# Altium project rfm_dev_board.PrjPcb
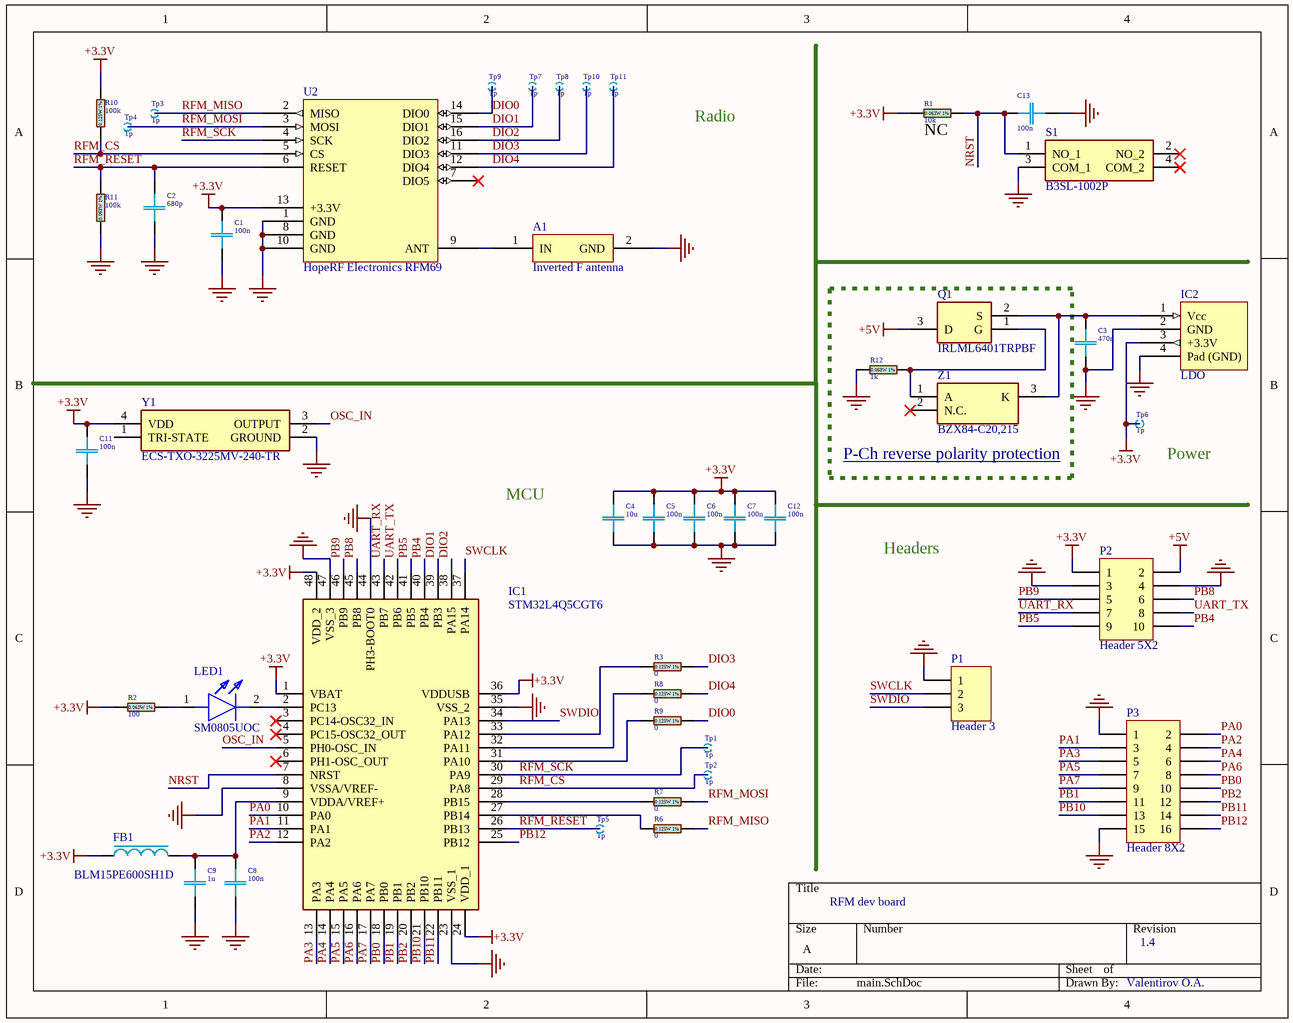
[diagram p0: main.SchDoc]
1 sheet, 46 parts. Net scope: global (net labels, ports and power ports of the same name join across sheets).
Board file: main.PcbDoc

## Sheet main.SchDoc
size A; SheetNumber: 1; SheetTotal: 1; SPICEModelCacheUNHDKLWC: <root> / <DocumentId>UNHDKLWC</DocumentId> / </root>

### Parts
A1  Inverted F antenna  [Invertef_F-footprint]  (net tie, no BOM)
C1  100n  [C 0402(1005)x0.5]
C2  680p  [C 0402(1005)x0.5]
C3  470n  [C 0603(1608)x0.8]
C4  10u  [C 0402(1005)x0.5]
C5  100n  [C 0402(1005)x0.5]
C6  100n  [C 0402(1005)x0.5]
C7  100n  [C 0402(1005)x0.5]
C8  100n  [C 0402(1005)x0.5]
C9  1u  [C 0402(1005)x0.5]
C11  100n  [C 0402(1005)x0.5]
C12  100n  [C 0402(1005)x0.5]
C13  100n  [C 0402(1005)x0.5]
FB1  BLM15PE600SH1D  [NFZ15SG152SN10B]
IC1  STM32L4Q5CGT6  [QFP50P900X900X160-48N]
IC2  LDO  [SOT230P700X180-4N]
LED1  SM0805UOC  [SM0805UOC]
P1  Header 3  [HDR1X3]
P2  Header 5X2  [HDR2X5]
P3  Header 8X2  [HDR2X8]
Q1  IRLML6401TRPBF  [SOT95P237X112-3N]
R1  10k  [R 0402(1005)-1%]
R2  100  [R 0402(1005)-1%]
R3  0  [R 0805(2012)-1%]
R6  0  [R 0805(2012)-1%]
R7  0  [R 0805(2012)-1%]
R8  0  [R 0805(2012)-1%]
R9  0  [R 0805(2012)-1%]
R10  100k  [R 0805(2012)-1%]
R11  100k  [R 0402(1005)-1%]
R12  1k  [R 0402(1005)-1%]
S1  B3SL-1002P  [B3SL1002P]
Tp1  Tp  [Tp-0.5]  (no BOM)
Tp2  Tp  [Tp-0.5]  (no BOM)
Tp3  Tp  [Tp-0.5]  (no BOM)
Tp4  Tp  [Tp-0.5]  (no BOM)
Tp5  Tp  [Tp-0.5]  (no BOM)
Tp6  Tp  [Tp-0.5]  (no BOM)
Tp7  Tp  [Tp-0.5]  (no BOM)
Tp8  Tp  [Tp-0.5]  (no BOM)
Tp9  Tp  [Tp-0.5]  (no BOM)
Tp10  Tp  [Tp-0.5]  (no BOM)
Tp11  Tp  [Tp-0.5]  (no BOM)
U2  HopeRF Electronics RFM69  [CAC-200P1600X1600-16N]
Y1  ECS-TXO-3225MV-240-TR  [ECSTXO3225MV240TR]
Z1  BZX84-C20,215  [BZX84C20215]

### Blocks framed on the sheet
P-Ch reverse polarity protection: Q1 R12 Z1

### Nets
+3.3V: C1.1 C4.1 C5.1 C6.1 C7.1 C11.1 C12.1 FB1.1 IC1.1(VBAT) IC1.24(VDD_1) IC1.36(VDDUSB) IC1.48(VDD_2) IC2.3(+3.3V) P2.1 R1.1 R2.1 R10.2 Tp6.1 U2.13(+3.3V) Y1.4(VDD)
+5V: P2.2 Q1.3(D)
GND: A1.2(GND) C1.2 C2.2 C3.2 C4.2 C5.2 C6.2 C7.2 C8.2 C9.2 C11.2 C12.2 C13.2 IC1.8(VSSA/VREF-) IC1.23(VSS_1) IC1.35(VSS_2) IC1.44(PH3-BOOT0) IC1.47(VSS_3) IC2.2(GND) IC2.4(Pad_(GND)) P1.1 P2.3 P2.4 P3.1 P3.15 R11.1 R12.1 S1.3(COM_1) U2.1(GND) U2.8(GND) U2.10(GND) Y1.2(GROUND)
DIO0: R9.2 Tp9.1 U2.14(DIO0)
DIO1: IC1.39(PB3) Tp7.1 U2.15(DIO1)
DIO2: IC1.38(PA15) Tp8.1 U2.16(DIO2)
DIO3: R3.2 Tp10.1 U2.11(DIO3)
DIO4: R8.2 Tp11.1 U2.12(DIO4)
NRST: C13.1 IC1.7(NRST) R1.2 S1.1(NO_1)
OSC_IN: IC1.5(PH0-OSC_IN) Y1.3(OUTPUT)
PA0: IC1.10(PA0) P3.2
PA1: IC1.11(PA1) P3.3
PA2: IC1.12(PA2) P3.4
PA3: IC1.13(PA3) P3.5
PA4: IC1.14(PA4) P3.6
PA5: IC1.15(PA5) P3.7
PA6: IC1.16(PA6) P3.8
PA7: IC1.17(PA7) P3.9
PB0: IC1.18(PB0) P3.10
PB1: IC1.19(PB1) P3.11
PB2: IC1.20(PB2) P3.12
PB4: IC1.40(PB4) P2.10
PB5: IC1.41(PB5) P2.9
PB8: IC1.45(PB8) P2.6
PB9: IC1.46(PB9) P2.5
PB10: IC1.21(PB10) P3.13
PB11: IC1.22(PB11) P3.14
PB12: IC1.25(PB12) P3.16
RFM_CS: IC1.29(PA8) R10.1 Tp2.1 U2.5(CS)
RFM_MISO: R6.2 Tp3.1 U2.2(MISO)
RFM_MOSI: R7.2 Tp4.1 U2.3(MOSI)
RFM_RESET: C2.1 IC1.26(PB13) R11.2 Tp5.1 U2.6(RESET)
RFM_SCK: IC1.30(PA9) Tp1.1 U2.4(SCK)
SWCLK: IC1.37(PA14) P1.2
SWDIO: IC1.34(PA13) P1.3
UART_RX: IC1.43(PB7) P2.7
UART_TX: IC1.42(PB6) P2.8
NetA1_1: A1.1(IN) U2.9(ANT)
NetC3_1: C3.1 IC2.1(Vcc) Q1.2(S) Z1.3(K)
NetC8_1: C8.1 C9.1 FB1.2 IC1.9(VDDA/VREF+)
NetIC1_2: IC1.2(PC13) LED1.2(K)
NetIC1_27: IC1.27(PB14) R6.1
NetIC1_28: IC1.28(PB15) R7.1
NetIC1_31: IC1.31(PA10) R9.1
NetIC1_32: IC1.32(PA11) R8.1
NetIC1_33: IC1.33(PA12) R3.1
NetLED1_1: LED1.1(A) R2.2
NetQ1_1: Q1.1(G) R12.2 Z1.1(A)

Not connected (* = marked no-connect by the designer): IC1 3(PC14-OSC32_IN)* 4(PC15-OSC32_OUT)* 6(PH1-OSC_OUT)*; S1 2(NO_2)* 4(COM_2)*; U2 7(DIO5)*; Y1 1(TRI-STATE); Z1 2(N.C.)*

### Notes on the sheet
- Radio
- (near R1) NC
- MCU
- (near Tp6) Power
- Headers
- RFM dev board
- 1.4
- Valentirov O.A.
- (in symbol R 0402-1%) 0.063W 1%
- (in symbol R 0805-1%) 0.125W 1%

### Library data of the parts
A1 = inverted_F
C1 C2 C4-C9 C11-C13 = C 0402    16V X5R - 0*: SMD 0402     16V X5R 10%; Manufacturer: Samsung; TYPE: Capacitors; Tolerance %: ±20%; Package-mm: 1005; Part Number: *; Mount Type: SMT; Publisher: Hefest; Manufacturer Alternate: *; Part Number Alternate: *; Published: 07.04.2019; Supplier 1: Comet; Supplier Part Number 1: *; RoHS: Y; Technology: Ceramic  MLCC; Package: 0402; VDC: 16V; TempCo: X5R; VAC: *; ESR Ohm: *; ComponentLink1Description: Datasheet Link; ComponentLink1URL: https://store.comet.bg/download-file.php?id=11; Temperature Range: -55°C ~ +85°C; Price: *
  C1 C5-C8 C11-C13: Value: 100n
  C2: Value: 680p
  C4: Value: 10u
  C9: Value: 1u
C3 = C 0603    50V X7R - 100n: SMD 0603     50V X7R   5%; Part Number: CL10B104JB8NNNC; Manufacturer: Samsung; TYPE: Capacitors; Package-mm: 1608; Mount Type: SMT; Publisher: Hefest; Manufacturer Alternate: *; Part Number Alternate: *; Published: 07.04.2019; Supplier 1: Comet; Supplier Part Number 1: C0603 100nF 50V X7R 5% SAMSUNG; RoHS: Y; Technology: Ceramic  MLCC; Package: 0603; VDC: 50V; TempCo: X7R; Tolerance %: ±5%; VAC: *; ESR Ohm: *; ComponentLink1Description: Datasheet Link; ComponentLink1URL: https://store.comet.bg/download-file.php?id=11; Temperature Range: -55°C ~ +125°C; Price: 0.020; Value: 470n
FB1 = BLM15PE600SH1D: Ferrite Bead; Manufacturer_Name: Murata Electronics; Datasheet Link: https://www.murata.com/en-global/products/productdetail.aspx?cate=luNoiseSupprFilteChipFerriBead&partno=BLM15PE600SH1%23; Height: 0.55mm; Manufacturer_Part_Number: BLM15PE600SH1D; Mouser Part Number: 81-BLM15PE600SH1D; Mouser Price/Stock: https://www.mouser.co.uk/ProductDetail/Murata-Electronics/BLM15PE600SH1D?qs=DRkmTr78QATf%2FmEselssqw%3D%3D
IC1 = STM32L4Q5CGT6: Integrated Circuit; Manufacturer_Name: STMicroelectronics; Datasheet Link: https://www.st.com/resource/en/datasheet/stm32l4q5ag.pdf; Height: 1.6mm; Manufacturer_Part_Number: STM32L4Q5CGT6; Mouser Part Number: 511-STM32L4Q5CGT6; Mouser Price/Stock: https://www.mouser.co.uk/ProductDetail/STMicroelectronics/STM32L4Q5CGT6?qs=xZ%2FP%252Ba9zWqa0QI8asRSMRw%3D%3D
IC2 = LM3940IMP-3.3: LDO voltage regulator. In 4.5V - 5.5V. Out 3.3V; ComponentLink1Description: Datasheet; ComponentLink1URL: https://www.ti.com/lit/ds/symlink/lm3940.pdf; ComponentLink2Description: rcscomponents; ComponentLink2URL: https://www.rcscomponents.kiev.ua/product/lm3940imp-3-3-nopb_32246.html; ComponentLink3Description: Mouser; ComponentLink3URL: https://eu.mouser.com/ProductDetail/Texas-Instruments/LM3940IMP-3.3-NOPB?qs=QbsRYf82W3EIVCEt3IRFTQ%3D%3D&srsltid=AfmBOorg8hqzI-HA3PvQj6bcO1LosyJxFIDZmXf61J2HGG2munIuMdGH
LED1 = SM0805UOC: LED; Manufacturer_Name: Bivar; Datasheet Link: https://www.bivar.com/parts_content/Datasheets/SM0805UOC.pdf; Height: 1.054mm; Manufacturer_Part_Number: SM0805UOC; Mouser Part Number: 749-SM0805UOC; Mouser Price/Stock: https://www.mouser.co.uk/ProductDetail/Bivar/SM0805UOC?qs=jaLxTFIJCivUzv0TgwDi7A%3D%3D
P1 = Header 3: Header, 3-Pin; LatestRevisionDate: 17-Jul-2002; LatestRevisionNote: Re-released for DXP Platform.; Publisher: Altium Limited
P2 = Header 5X2: Header, 5-Pin, Dual row; LatestRevisionDate: 17-Jul-2002; LatestRevisionNote: Re-released for DXP Platform.; Publisher: Altium Limited
P3 = Header 8X2: Header, 8-Pin, Dual row; LatestRevisionDate: 17-Jul-2002; LatestRevisionNote: Re-released for DXP Platform.; Publisher: Altium Limited
Q1 = IRLML6401TRPBF: Transistor; Manufacturer_Name: Infineon; Datasheet Link: https://www.infineon.com/dgdl/irlml6401pbf.pdf?fileId=5546d462533600a401535668b96d2634; Height: 1.12mm; Manufacturer_Part_Number: IRLML6401TRPBF; Mouser Part Number: 942-IRLML6401TRPBF; Mouser Price/Stock: https://www.mouser.co.uk/ProductDetail/Infineon-Technologies/IRLML6401TRPBF?qs=9%252BKlkBgLFf1wviSVMCNr8A%3D%3D; Arrow Part Number: IRLML6401TRPBF; Arrow Price/Stock: https://www.arrow.com/en/products/irlml6401trpbf/infineon-technologies-ag?region=europe
R1 R2 R11 R12 = R 0402-1%: SMD 0402 0.063W 1%   50V; Manufacturer: YAGEO; TempCo: ±100ppm/°C; Package-mm: 1005; Value Code: 1001; Power: 0.0625W; Part Number: *; Mount Type: SMT; Publisher: Hefest; Manufacturer Alternate: *; Published: 07.04.2019; Supplier 1: Comet; Supplier Part Number 1: R0402 1.0K 1% YAG/ASJ; RoHS: Y; Technology: Thick film; Package: 0402; VDC: 50V; Tolerance %: ±1%; ComponentLink1Description: Datasheet Link; ComponentLink1URL: https://store.comet.bg/download-file.php?id=1224; Temperature Range: -55°C ~ +155°C; Price: 0.015; Part Number Alternate: *; TYPE: Resistor
  R1: Value: 10k
  R2: Value: 100
  R11: Value: 100k
  R12: Value: 1k
R3 R6-R10 = R 0805-1%: SMD 0805 0.125W 1% 150V; Manufacturer: YAGEO; TempCo: ±100ppm/°C; Package-mm: 2012; Value Code: 1001; Part Number: *; Mount Type: SMT; Publisher: Hefest; Manufacturer Alternate: *; Published: 07.04.2019; Supplier 1: Comet; Supplier Part Number 1: R0805 1.0K 1% YAG/ASJ; RoHS: Y; Technology: Thick film; Package: 0805; VDC: 150V; Tolerance %: ±1%; ComponentLink1Description: Datasheet Link; ComponentLink1URL: https://store.comet.bg/download-file.php?id=1224; Temperature Range: -55°C ~ +155°C; Price: 0.031; Part Number Alternate: *; TYPE: Resistor; Power: 0.125W
  R3 R6-R9: Value: 0
  R10: Value: 100k
S1 = B3SL-1002P: Switch; Manufacturer_Name: Omron Electronics; Datasheet Link: https://www.mouser.com/datasheet/2/307/en-b3sl-1093544.pdf; Height: 3.8mm; Manufacturer_Part_Number: B3SL-1002P; Mouser Part Number: 653-B3SL-1002P; Mouser Price/Stock: https://www.mouser.co.uk/ProductDetail/Omron-Electronics/B3SL-1002P?qs=h8kCHL4kpM7r31L1Z%2F%2FPBA%3D%3D; Arrow Part Number: B3SL-1002P; Arrow Price/Stock: https://www.arrow.com/en/products/b3sl-1002p/omron?region=nac
Tp1-Tp11 = Tp: TestPoint; TYPE: TestPoint; Technology: PCB; Mount Type: SMT; Package: TestPoint; Published: 07.04.2019; Publisher: Hefest; Value: Tp
U2 = RFM69
Y1 = ECS-TXO-3225MV-240-TR: Crystal or Oscillator; Manufacturer_Name: ECS; Datasheet Link: https://eu.mouser.com/datasheet/2/122/ECS-TXO-3225MV-1634330.pdf; Height: 1.2mm; Manufacturer_Part_Number: ECS-TXO-3225MV-240-TR; Mouser Part Number: 520-TXO-3225MV-240-T; Mouser Price/Stock: https://www.mouser.co.uk/ProductDetail/ECS/ECS-TXO-3225MV-240-TR?qs=d0WKAl%252BL4KYXn7UuwSFJGQ%3D%3D; Arrow Part Number: ECS-TXO-3225MV-240-TR; Arrow Price/Stock: https://www.arrow.com/en/products/ecs-txo-3225mv-240-tr/ecs-international?region=nac
Z1 = BZX84-C20,215: Zener Diode; Manufacturer_Name: Nexperia; Datasheet Link: https://assets.nexperia.com/documents/data-sheet/BZX84_SER.pdf; Height: 1.1mm; Manufacturer_Part_Number: BZX84-C20,215; Mouser Part Number: 771-BZX84-C20-T/R; Mouser Price/Stock: https://www.mouser.co.uk/ProductDetail/Nexperia/BZX84-C20215?qs=me8TqzrmIYUtilMGgZdKsw%3D%3D; Arrow Part Number: BZX84-C20,215; Arrow Price/Stock: https://www.arrow.com/en/products/bzx84-c20215/nexperia